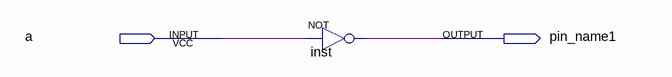
[diagram p0: schematic sheet]
// Quartus schematic Aula1.bdf as structural Verilog: 1 symbols, 2 pins
module Aula1 (
  input  a,
  output pin_name1
);

  not inst (pin_name1, a);
endmodule
